# EAGLE schematic SM2000 (EAGLE 6.5.0)

## Sheet 1 of 4
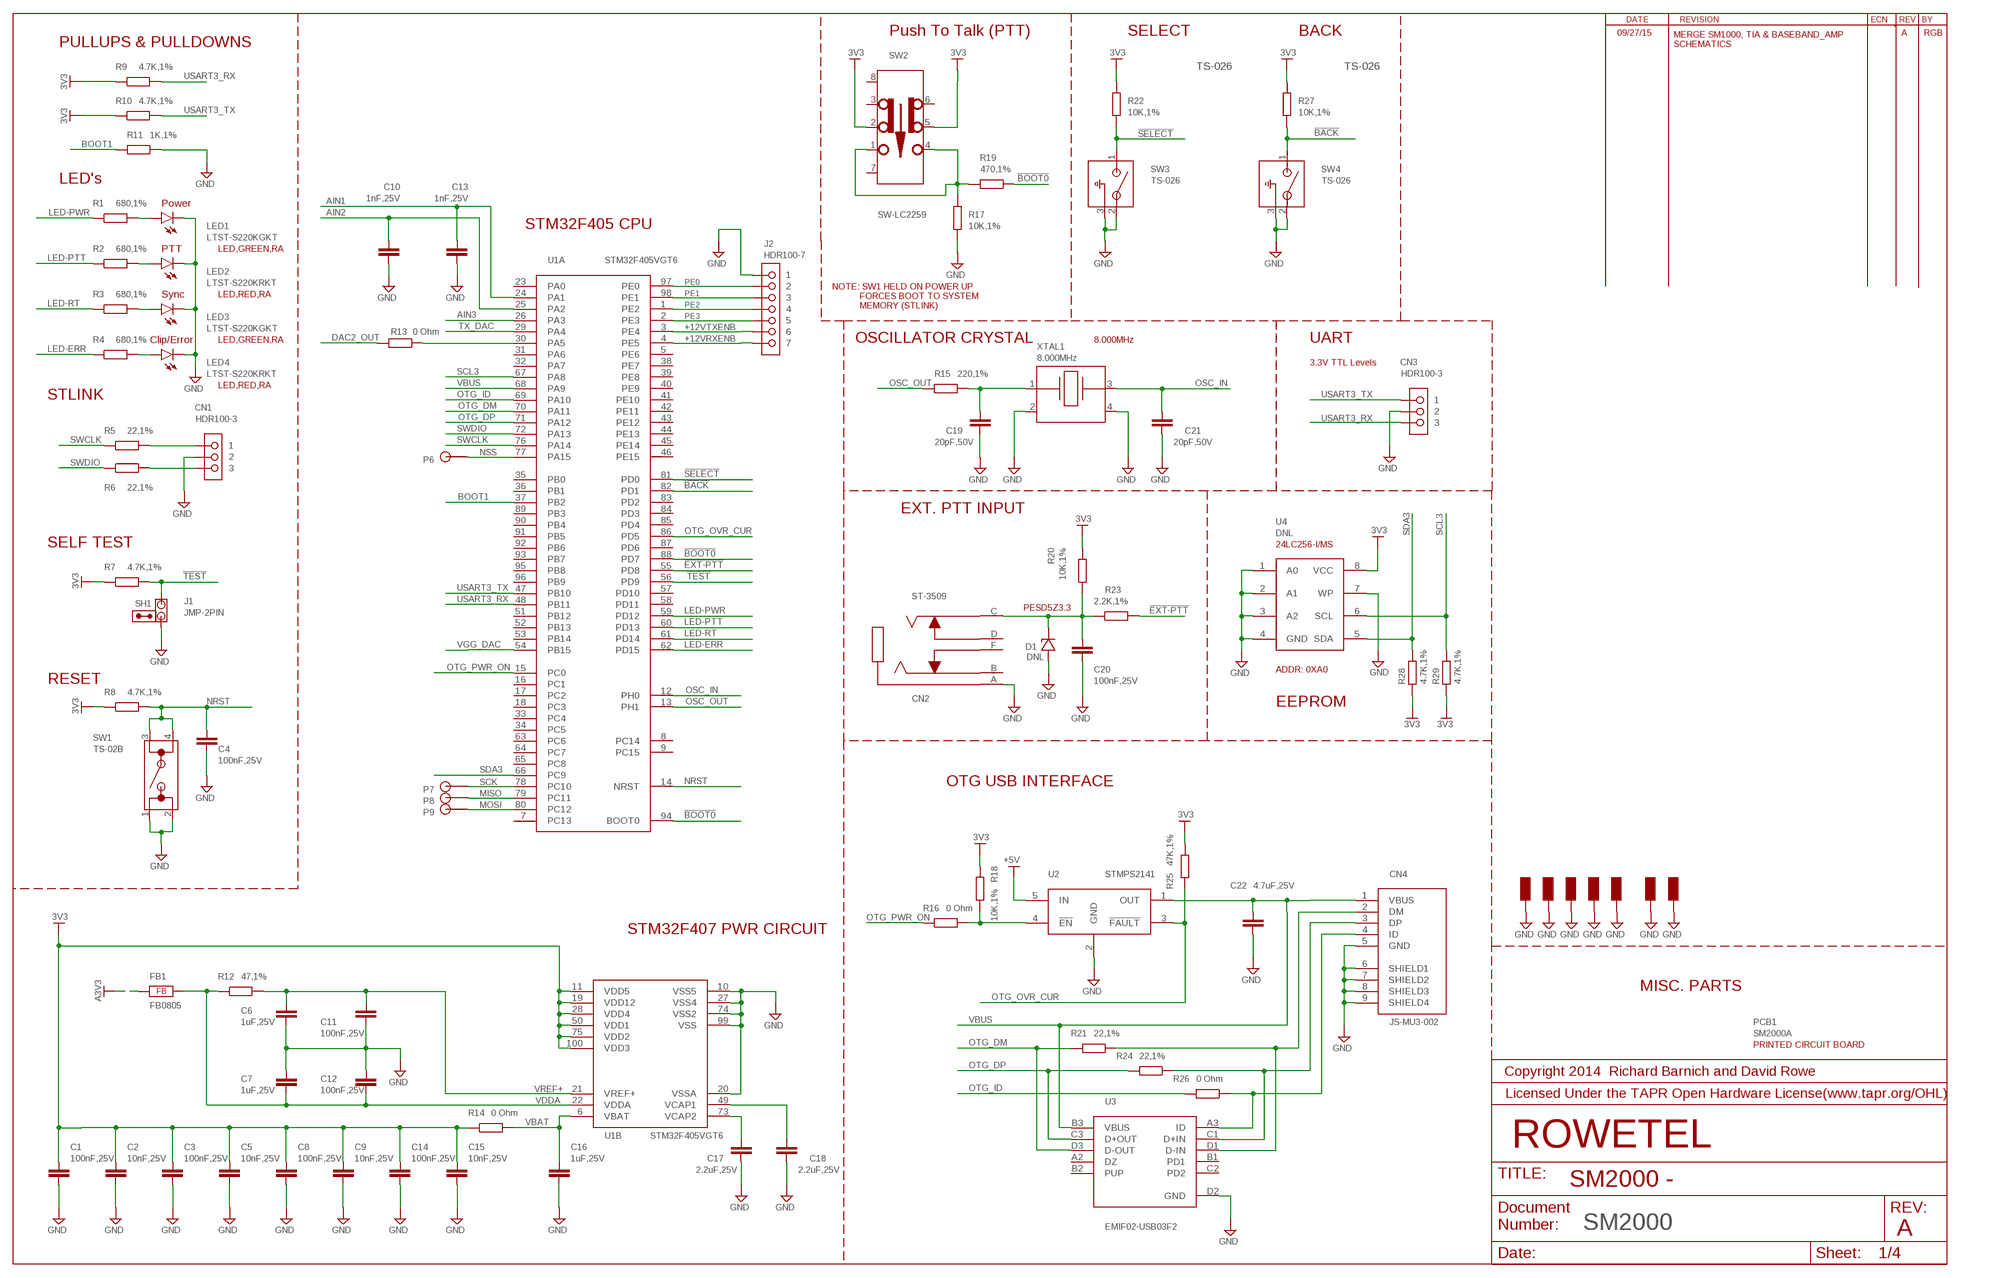
[diagram p0: schematic, sheet 1]

### Parts
C1  100nF,25V  CAP-0805  [C0805]
C2  10nF,25V  CAP-0805  [C0805]
C3  100nF,25V  CAP-0805  [C0805]
C4  100nF,25V  CAP-0805  [C0805]
C5  10nF,25V  CAP-0805  [C0805]
C6  1uF,25V  CAP-0805  [C0805]
C7  1uF,25V  CAP-0805  [C0805]
C8  100nF,25V  CAP-0805  [C0805]
C9  10nF,25V  CAP-0805  [C0805]
C10  1nF,25V  CAP-0805  [C0805]
C11  100nF,25V  CAP-0805  [C0805]
C12  100nF,25V  CAP-0805  [C0805]
C13  1nF,25V  CAP-0805  [C0805]
C14  100nF,25V  CAP-0805  [C0805]
C15  10nF,25V  CAP-0805  [C0805]
C16  1uF,25V  CAP-0805  [C0805]
C17  2.2uF,25V  CAP-0805  [C0805]
C18  2.2uF,25V  CAP-0805  [C0805]
C19  20pF,50V  CAP-0805  [C0805]
C20  100nF,25V  CAP-0805  [C0805]
C21  20pF,50V  CAP-0805  [C0805]
C22  4.7uF,25V  CAP-0805  [C0805]
CN1  HDR100-3  [HDR100-3]
CN2  ST-3509  [ST-3509]
CN3  HDR100-3  [HDR100-3]
CN4  JS-MU3-002  [JI-MU3-002]
D1  DNL  PESD5ZX  [SOD523]
FB1  FB0805  [FE0805]
J1  JMP-2PIN  [JMPR-2PIN]
J2  HDR100-7  [HDR100-7]
LED1  LTST-S220KGKT  LTST-S220K  [LTST-S2200K]
LED2  LTST-S220KRKT  LTST-S220K  [LTST-S2200K]
LED3  LTST-S220KGKT  LTST-S220K  [LTST-S2200K]
LED4  LTST-S220KRKT  LTST-S220K  [LTST-S2200K]
P6  TPAD50  [TPAD50]
P7  TPAD50  [TPAD50]
P8  TPAD50  [TPAD50]
P9  TPAD50  [TPAD50]
PCB1  SM2000A  PCB  [NOPACKAGE]
R1  680,1%  RES-0805  [R0805]
R2  680,1%  RES-0805  [R0805]
R3  680,1%  RES-0805  [R0805]
R4  680,1%  RES-0805  [R0805]
R5  22,1%  RES-0805  [R0805]
R6  22,1%  RES-0805  [R0805]
R7  4.7K,1%  RES-0805  [R0805]
R8  4.7K,1%  RES-0805  [R0805]
R9  4.7K,1%  RES-0805  [R0805]
R10  4.7K,1%  RES-0805  [R0805]
R11  1K,1%  RES-0805  [R0805]
R12  47,1%  RES-0805  [R0805]
R13  0 Ohm  RES-0805  [R0805]
R14  0 Ohm  RES-0805  [R0805]
R15  220,1%  RES-0805  [R0805]
R16  0 Ohm  RES-0805  [R0805]
R17  10K,1%  RES-0805  [R0805]
R18  10K,1%  RES-0805  [R0805]
R19  470,1%  RES-0805  [R0805]
R20  10K,1%  RES-0805  [R0805]
R21  22,1%  RES-0805  [R0805]
R22  10K,1%  RES-0805  [R0805]
R23  2.2K,1%  RES-0805  [R0805]
R24  22,1%  RES-0805  [R0805]
R25  47K,1%  RES-0805  [R0805]
R26  0 Ohm  RES-0805  [R0805]
R27  10K,1%  RES-0805  [R0805]
R28  4.7K,1%  RES-0805  [R0805]
R29  4.7K,1%  RES-0805  [R0805]
S1  SGND  [SGND]
S2  SGND  [SGND]
S3  SGND  [SGND]
S4  SGND  [SGND]
S5  SGND  [SGND]
S6  SGND  [SGND]
S7  SGND  [SGND]
SH1  SHUNT,0.1IN  [NOPACKAGE]
SW1  TS-02B  [TS-02B]
SW2  SW-LC2259  [SW-LC2259]
SW3  TS-026  [TS-026]
SW4  TS-026  [TS-026]
U1  STM32F405VGT6  STM32F407  [LQFP100-14]
U2  STMPS2141  [SOT23-5L]
U3  EMIF02-USB03F2  [ECOPACK-11]
U4  DNL  I2C-EEPROM-256K  [SOIC8]
XTAL1  8.000MHz  CTS-405  [CTS-405]

### Nets
3V3: C1.1 C2.1 C3.1 C5.1 C8.1 C9.1 C14.1 C15.1 R7.1 R8.1 R9.1 R10.1 R14.1 R18.2 R20.1 R22.2 R25.1 R27.2 R28.1 R29.1 SW2.2 SW2.5 U1.11(B:VDD5) U1.19(B:VDD12) U1.28(B:VDD4) U1.50(B:VDD1) U1.75(B:VDD2) U1.100(B:VDD3) U4.8(VCC) ; also sheet 2,4
!BACK!: R27.1 SW4.1 U1.82(A:PD1)
!BOOT0!: R19.1 U1.88(A:PD7) U1.94(A:BOOT0)
!EXT-PTT!: R23.2 U1.55(A:PD8)
!SELECT!: R22.1 SW3.1 U1.81(A:PD0)
!TEST!: J1.1 R7.2 U1.56(A:PD9)
+5V: U2.5(IN) ; also sheet 2,4
+12VRXENB: J2.7 U1.4(A:PE5) ; also sheet 2
+12VTXENB: J2.6 U1.3(A:PE4) ; also sheet 2
A3V3: FB1.1 ; also sheet 2,3
AIN1: C13.1 U1.24(A:PA1) ; also sheet 4
AIN2: C10.1 U1.25(A:PA2) ; also sheet 2
AIN3: U1.26(A:PA3) ; also sheet 3
BOOT1: R11.2 U1.37(A:PB2)
DAC2_OUT: R13.2 ; also sheet 2
GND: C1.2 C2.2 C3.2 C4.2 C5.2 C6.2 C7.2 C8.2 C9.2 C10.2 C11.2 C12.2 C13.2 C14.2 C15.2 C16.2 C17.2 C18.2 C19.2 C20.2 C21.2 C22.2 CN1.2 CN2.A CN3.2 CN4.5(GND) CN4.6(SHIELD1) CN4.7(SHIELD2) CN4.8(SHIELD3) CN4.9(SHIELD4) D1.A J1.2 J2.1 LED1.C LED2.C LED3.C LED4.C R11.1 R17.1 S1.SGND S2.SGND S3.SGND S4.SGND S5.SGND S6.SGND S7.SGND SW1.1 SW1.2 SW3.2 SW3.3 SW4.2 SW4.3 U1.10(B:VSS5) U1.20(B:VSSA) U1.27(B:VSS4) U1.74(B:VSS2) U1.99(B:VSS) U2.2(GND) U3.D2(GND) U4.1(A0) U4.2(A1) U4.3(A2) U4.4(GND) U4.7(WP) XTAL1.2 XTAL1.4 ; also sheet 2,3,4
LED-ERR: R4.1 U1.62(A:PD15)
LED-PTT: R2.1 U1.60(A:PD13)
LED-PWR: R1.1 U1.59(A:PD12)
LED-RT: R3.1 U1.61(A:PD14)
MISO: P8.1 U1.79(A:PC11)
MOSI: P9.1 U1.80(A:PC12)
N$1: C17.1 U1.73(B:VCAP2)
N$3: C18.1 U1.49(B:VCAP1)
N$6: CN1.3 R6.2
N$7: CN1.1 R5.2
N$10: C19.1 R15.2 XTAL1.1
N$13: R13.1 U1.30(A:PA5)
N$14: R17.2 R19.2 SW2.1 SW2.4
N$15: C20.1 CN2.C D1.C R20.2 R23.1
N$16: LED1.A R1.2
N$17: LED2.A R2.2
N$18: LED3.A R3.2
N$20: LED4.A R4.2
N$22: CN4.3(DP) R24.1 U3.C1(D+IN)
N$23: CN4.2(DM) R21.1 U3.D1(D-IN)
N$28: CN4.4(ID) R26.1 U3.A3(ID)
N$31: R16.2 R18.1 U2.4(!EN!)
NRST: C4.1 R8.2 SW1.3 SW1.4 U1.14(A:NRST)
NSS: P6.1 U1.77(A:PA15)
OSC_IN: C21.1 U1.12(A:PH0) XTAL1.3
OSC_OUT: R15.1 U1.13(A:PH1)
OTG_DM: R21.2 U1.70(A:PA11) U3.D3(D-OUT)
OTG_DP: R24.2 U1.71(A:PA12) U3.C3(D+OUT)
OTG_ID: R26.2 U1.69(A:PA10)
OTG_OVR_CUR: R25.2 U1.86(A:PD5) U2.3(!FAULT!)
OTG_PWR_ON: R16.1 U1.15(A:PC0)
PE0: J2.2 U1.97(A:PE0)
PE1: J2.3 U1.98(A:PE1)
PE2: J2.4 U1.1(A:PE2)
PE3: J2.5 U1.2(A:PE3)
SCK: P7.1 U1.78(A:PC10)
SCL3: R29.2 U1.67(A:PA8) U4.6(SCL) ; also sheet 4
SDA3: R28.2 U1.66(A:PC9) U4.5(SDA) ; also sheet 4
SWCLK: R5.1 U1.76(A:PA14)
SWDIO: R6.1 U1.72(A:PA13)
TX_DAC: U1.29(A:PA4) ; also sheet 4
USART3_RX: CN3.3 R9.2 U1.48(A:PB11)
USART3_TX: CN3.1 R10.2 U1.47(A:PB10)
VBAT: C16.1 R14.2 U1.6(B:VBAT)
VBUS: C22.1 CN4.1(VBUS) U1.68(A:PA9) U2.1(OUT) U3.B3(VBUS)
VDDA: C7.1 C12.1 FB1.2 R12.1 U1.22(B:VDDA)
VGG_DAC: U1.54(A:PB15) ; also sheet 3
VREF+: C6.1 C11.1 R12.2 U1.21(B:VREF+)
Unconnected: CN2.B CN2.D CN2.F(E) SW2.3 SW2.6 SW2.7 SW2.8 U1.5(A:PE6) U1.7(A:PC13) U1.8(A:PC14) U1.9(A:PC15) U1.16(A:PC1) U1.17(A:PC2) U1.18(A:PC3) U1.23(A:PA0) U1.31(A:PA6) U1.32(A:PA7) U1.33(A:PC4) U1.34(A:PC5) U1.35(A:PB0) U1.36(A:PB1) U1.38(A:PE7) U1.39(A:PE8) U1.40(A:PE9) U1.41(A:PE10) U1.42(A:PE11) U1.43(A:PE12) U1.44(A:PE13) U1.45(A:PE14) U1.46(A:PE15) U1.51(A:PB12) U1.52(A:PB13) U1.53(A:PB14) U1.57(A:PD10) U1.58(A:PD11) U1.63(A:PC6) U1.64(A:PC7) U1.65(A:PC8) U1.83(A:PD2) U1.84(A:PD3) U1.85(A:PD4) U1.87(A:PD6) U1.89(A:PB3) U1.90(A:PB4) U1.91(A:PB5) U1.92(A:PB6) U1.93(A:PB7) U1.95(A:PB8) U1.96(A:PB9) U3.A2(DZ) U3.B1(PD1) U3.B2(PUP) U3.C2(PD2)

### Notes on the sheet
- Push To Talk (PTT) | SELECT | BACK | 09/27/15 | A | RGB
- PULLUPS & PULLDOWNS
- MERGE SM1000, TIA & BASEBAND_AMP
  SCHEMATICS
- TS-026 | TS-026
- LED's
- Power
- STM32F405 CPU
- PTT | LED,GREEN,RA
- Sync | LED,RED,RA
- NOTE: SW1 HELD ON POWER UP
             FORCES BOOT TO SYSTEM
             MEMORY (STLINK)
- Clip/Error | LED,GREEN,RA | OSCILLATOR CRYSTAL | 8.000MHz | UART
- 3.3V TTL Levels
- LED,RED,RA
- STLINK
- EXT. PTT INPUT
- SELF TEST | 24LC256-I/MS
- PESD5Z3.3
- ADDR: 0XA0
- RESET
- EEPROM
- OTG USB INTERFACE
- STM32F407 PWR CIRCUIT
- MISC. PARTS
- SM2000 -
- A

## Sheet 2 of 4
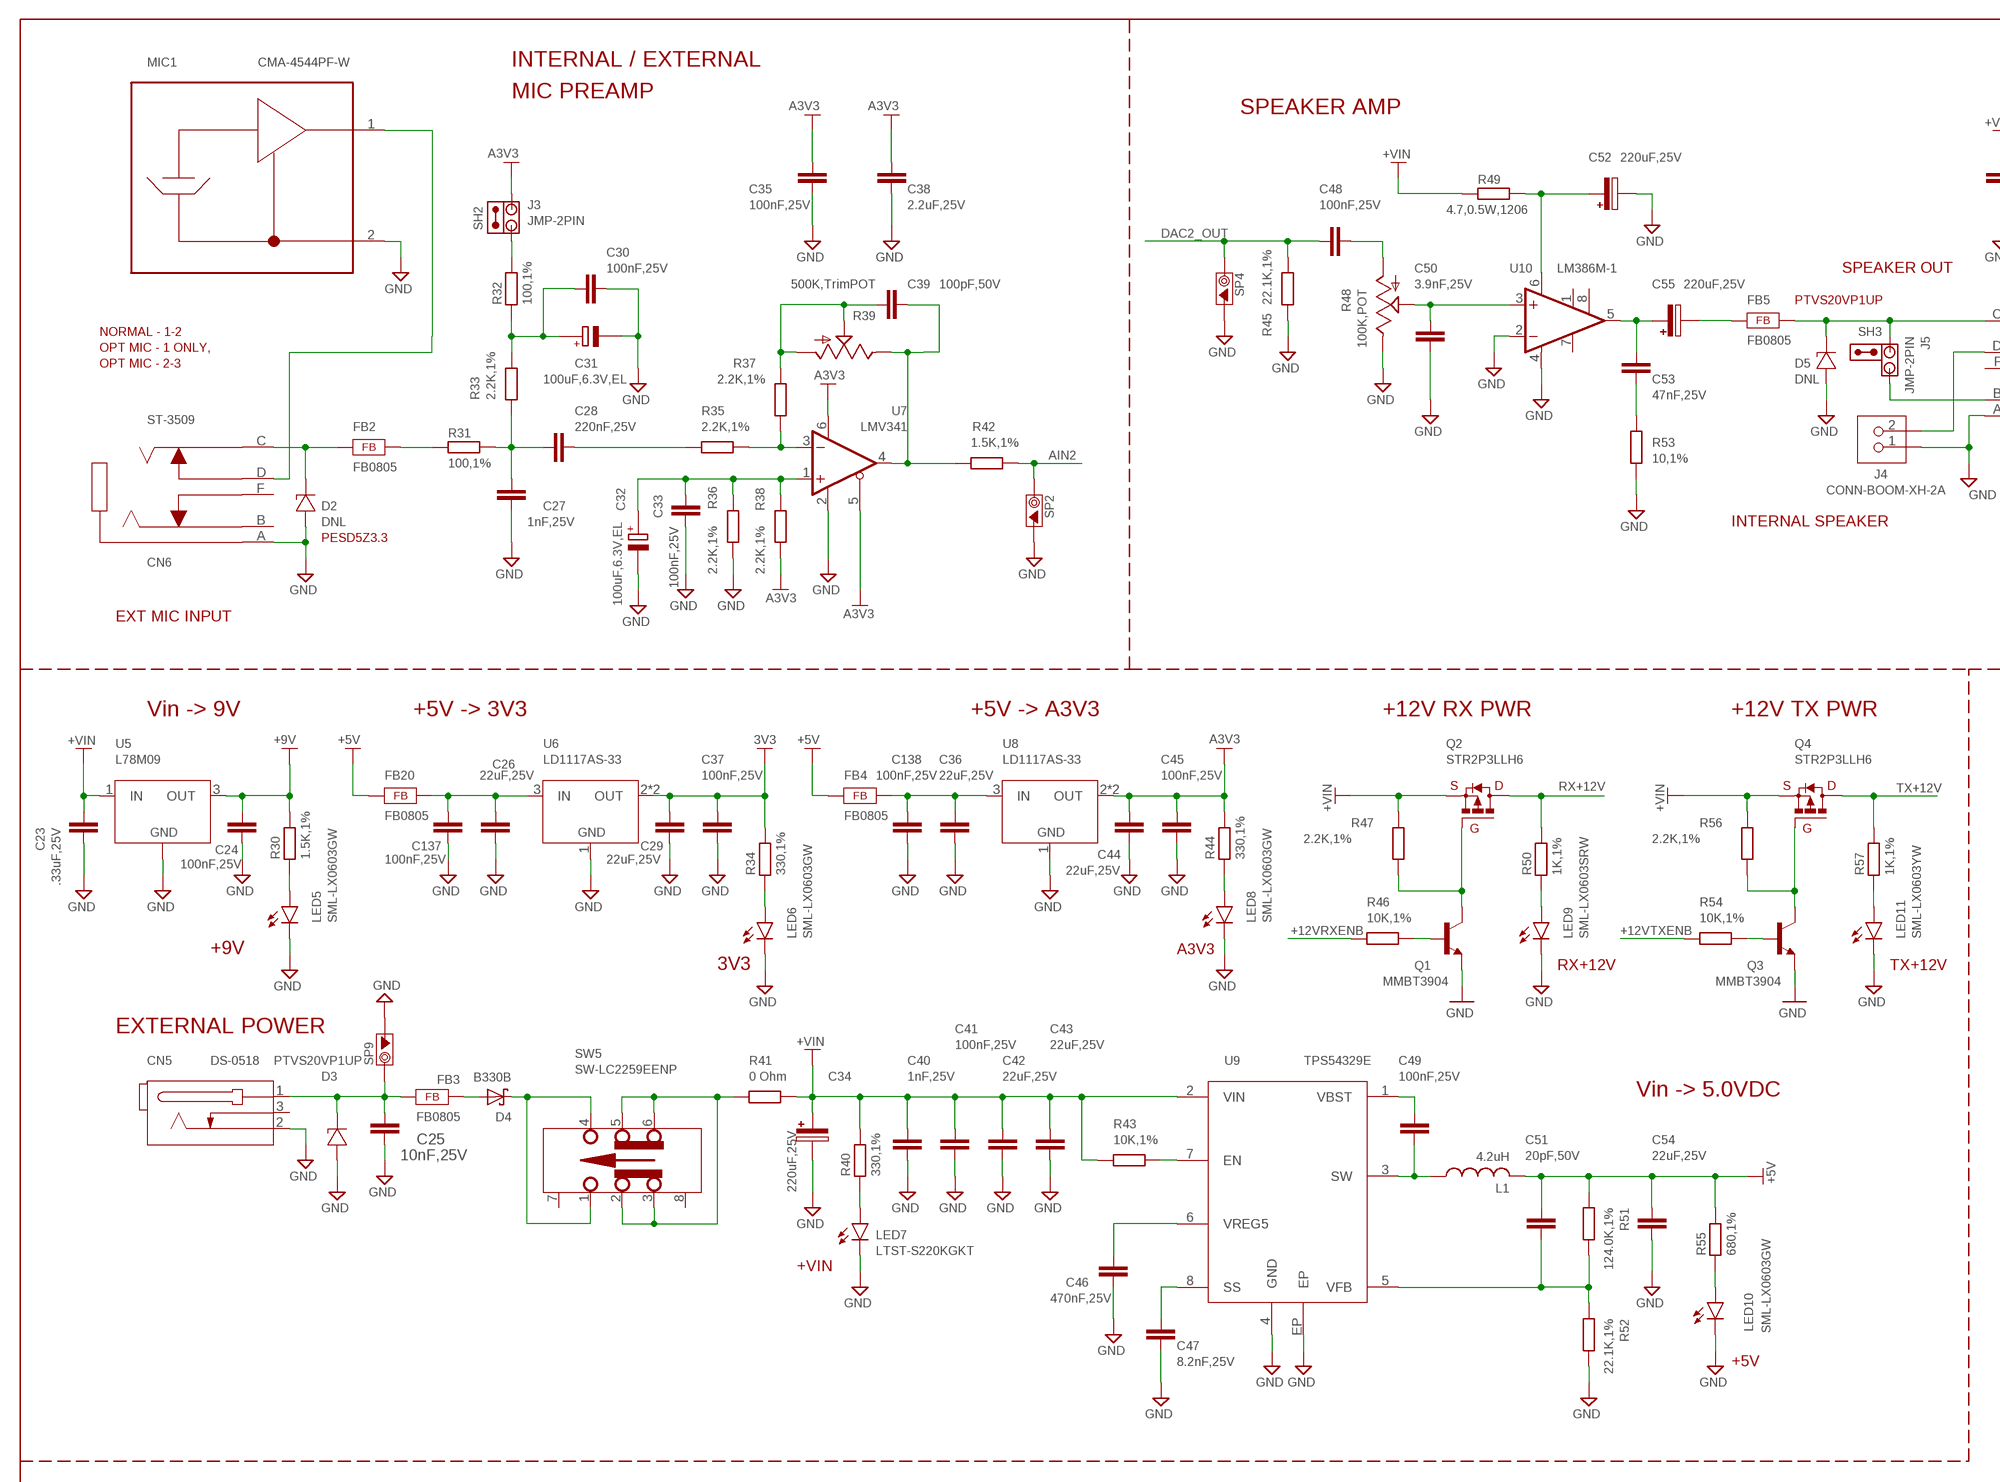
[diagram p1: schematic, sheet 2, part 1 of 2]
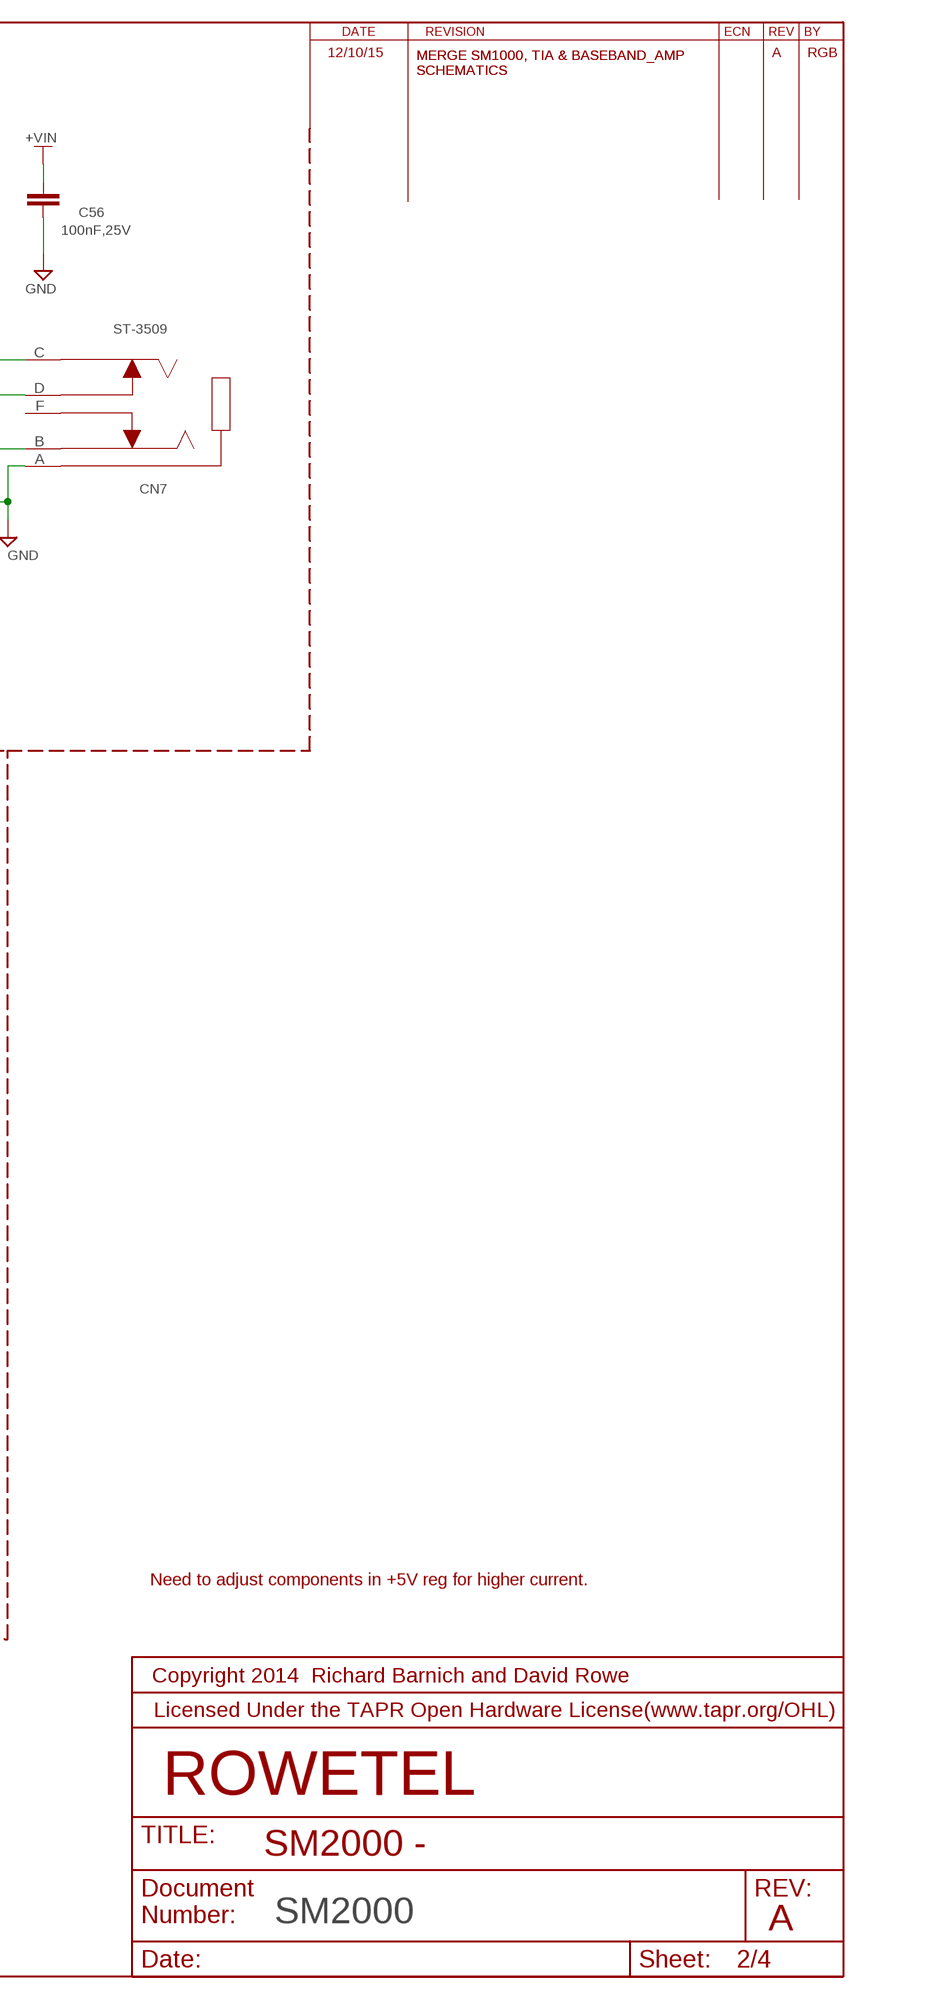
[diagram p2: schematic, sheet 2, part 2 of 2]

### Parts
C23  .33uF,25V  CAP-0805  [C0805]
C24  100nF,25V  CAP-0805  [C0805]
C25  10nF,25V  CAP-0805  [C0805]
C26  22uF,25V  CAP-1210  [C1210]
C27  1nF,25V  CAP-0805  [C0805]
C28  220nF,25V  CAP-0805  [C0805]
C29  22uF,25V  CAP-1210  [C1210]
C30  100nF,25V  CAP-0805  [C0805]
C31  100uF,6.3V,EL  NICHICON-WX-6.3  [NICHICON-WX-6.3]
C32  100uF,6.3V,EL  NICHICON-WX-6.3  [NICHICON-WX-6.3]
C33  100nF,25V  CAP-0805  [C0805]
C34  220uF,25V  CAP-CHEMI-MVE-HA0  [CAP-CHEMI-HA0]
C35  100nF,25V  CAP-0805  [C0805]
C36  22uF,25V  CAP-1210  [C1210]
C37  100nF,25V  CAP-0805  [C0805]
C38  2.2uF,25V  CAP-0805  [C0805]
C39  100pF,50V  CAP-0805  [C0805]
C40  1nF,25V  CAP-0805  [C0805]
C41  100nF,25V  CAP-0805  [C0805]
C42  22uF,25V  CAP-1210  [C1210]
C43  22uF,25V  CAP-1210  [C1210]
C44  22uF,25V  CAP-1210  [C1210]
C45  100nF,25V  CAP-0805  [C0805]
C46  470nF,25V  CAP-0805  [C0805]
C47  8.2nF,25V  CAP-0805  [C0805]
C48  100nF,25V  CAP-0805  [C0805]
C49  100nF,25V  CAP-0805  [C0805]
C50  3.9nF,25V  CAP-0805  [C0805]
C51  20pF,50V  CAP-0805  [C0805]
C52  220uF,25V  CAP-CHEMI-MVE-HA0  [CAP-CHEMI-HA0]
C53  47nF,25V  CAP-0805  [C0805]
C54  22uF,25V  CAP-1210  [C1210]
C55  220uF,25V  CAP-CHEMI-MVE-HA0  [CAP-CHEMI-HA0]
C56  100nF,25V  CAP-0805  [C0805]
C137  100nF,25V  CAP-0805  [C0805]
C138  100nF,25V  CAP-0805  [C0805]
CN5  DS-0518  [DS-0518]
CN6  ST-3509  [ST-3509]
CN7  ST-3509  [ST-3509]
D2  DNL  PESD5ZX  [SOD523]
D3  PTVS20VP1UP  [SOD128]
D4  B330B  [SMB]
D5  DNL  PTVS20VP1UP  [SOD128]
FB2  FB0805  [FE0805]
FB3  FB0805  [FE0805]
FB4  FB0805  [FE0805]
FB5  FB0805  [FE0805]
FB20  FB0805  [FE0805]
J3  JMP-2PIN  [JMPR-2PIN]
J4  CONN-BOOM-XH-2A  [CONN-BOOM-XH-2A]
J5  JMP-2PIN  [JMPR-2PIN]
L1  4.2uH  SRR5028  [SRR5028]
LED5  SML-LX0603GW  SML-LX0603SRW  [SML-LX0603SRW]
LED6  SML-LX0603GW  SML-LX0603SRW  [SML-LX0603SRW]
LED7  LTST-S220KGKT  LTST-S220K  [LTST-S2200K]
LED8  SML-LX0603GW  SML-LX0603SRW  [SML-LX0603SRW]
LED9  SML-LX0603SRW  [SML-LX0603SRW]
LED10  SML-LX0603GW  SML-LX0603SRW  [SML-LX0603SRW]
LED11  SML-LX0603YW  SML-LX0603SRW  [SML-LX0603SRW]
MIC1  CMA-4544PF-W  [CMA-4544PF-W]
Q1  MMBT3904  [SOT23]
Q2  STR2P3LLH6  [SOT23]
Q3  MMBT3904  [SOT23]
Q4  STR2P3LLH6  [SOT23]
R30  1.5K,1%  RES-0805  [R0805]
R31  100,1%  RES-0805  [R0805]
R32  100,1%  RES-0805  [R0805]
R33  2.2K,1%  RES-0805  [R0805]
R34  330,1%  RES-0805  [R0805]
R35  2.2K,1%  RES-0805  [R0805]
R36  2.2K,1%  RES-0805  [R0805]
R37  2.2K,1%  RES-0805  [R0805]
R38  2.2K,1%  RES-0805  [R0805]
R39  500K,TrimPOT  POT3361  [POT3361]
R40  330,1%  RES-0805  [R0805]
R41  0 Ohm  RES-0805  [R0805]
R42  1.5K,1%  RES-0805  [R0805]
R43  10K,1%  RES-0805  [R0805]
R44  330,1%  RES-0805  [R0805]
R45  22.1K,1%  RES-0805  [R0805]
R46  10K,1%  RES-0805  [R0805]
R47  2.2K,1%  RES-0805  [R0805]
R48  100K,POT  POT-3310C  [POT-3310C]
R49  4.7,0.5W,1206  RES-1206  [R1206]
R50  1K,1%  RES-0805  [R0805]
R51  124.0K,1%  RES-0805  [R0805]
R52  22.1K,1%  RES-0805  [R0805]
R53  10,1%  RES-0805  [R0805]
R54  10K,1%  RES-0805  [R0805]
R55  680,1%  RES-0805  [R0805]
R56  2.2K,1%  RES-0805  [R0805]
R57  1K,1%  RES-0805  [R0805]
SH2  SHUNT,0.1IN  [NOPACKAGE]
SH3  SHUNT,0.1IN  [NOPACKAGE]
SP2  SCOPE_PAD  [SCOPE_PAD]
SP4  SCOPE_PAD  [SCOPE_PAD]
SP9  SCOPE_PAD  [SCOPE_PAD]
SW5  SW-LC2259EENP  SW-LC2259  [SW-LC2259]
U5  L78M09  L78MXX  [DPAK]
U6  LD1117AS-33  LD1117AS33  [SOT223]
U7  LMV341  [SOT23-6]
U8  LD1117AS-33  LD1117AS33  [SOT223]
U9  TPS54329E  [PSO-DDA]
U10  LM386M-1  [SO08]

### Nets
3V3: C29.1 C37.1 R34.2 U6.2(OUT) U6.4(OUT) ; also sheet 1,4
+5V: C51.1 C54.1 FB4.1 FB20.1 L1.2 R51.1 R55.2 ; also sheet 1,4
+9V: C24.1 R30.2 U5.3(OUT) ; also sheet 3
+12VRXENB: R46.1 ; also sheet 1
+12VTXENB: R54.1 ; also sheet 1
+VIN: C23.1 C34.1 C40.1 C41.1 C42.1 C43.1 C56.1 Q2.2(S) Q4.2(S) R40.2 R41.2 R43.1 R47.2 R49.1 R56.2 U5.1(IN) U9.2(VIN)
A3V3: C35.1 C38.1 C44.1 C45.1 J3.2 R38.2 R44.2 U7.5(!SHDN!) U7.6(V+) U8.2(OUT) U8.4(OUT) ; also sheet 1,3
AIN2: R42.1 SP2.1 ; also sheet 1
DAC2_OUT: C48.1 R45.1 SP4.1 ; also sheet 1
GND: C23.2 C24.2 C25.2 C26.2 C27.2 C29.2 C30.2 C31.2(-) C32.2(-) C33.1 C34.2 C35.2 C36.2 C37.2 C38.2 C40.2 C41.2 C42.2 C43.2 C44.2 C45.2 C46.2 C47.2 C50.2 C52.2 C54.2 C56.2 C137.2 C138.2 CN5.2 CN6.A CN7.A D2.A D3.A D5.A J4.1 LED5.C LED6.C LED7.C LED8.C LED9.C LED10.C LED11.C MIC1.2 Q1.2(E) Q3.2(E) R36.2 R45.2 R48.1 R52.2 R53.2 SP2.2 SP4.2 SP9.2 U5.4(GND) U6.1(GND) U7.2(GND) U8.1(GND) U9.4(GND) U9.EP U10.2(-IN) U10.4(GND) ; also sheet 1,3,4
N$8: C53.1 C55.1 U10.5(OUT)
N$24: D4.A FB3.2
N$25: C27.1 C28.1 R31.2 R33.1
N$26: FB2.2 R31.1
N$27: C39.2 R39.1 R42.2 U7.4(OUT)
N$29: J3.1 R32.2
N$34: C48.2 R48.3
N$35: C28.2 R35.1
N$39: C50.1 R48.2 U10.3(+IN)
N$41: C39.1 R37.2 R39.2 R39.3
N$42: Q1.3(C) Q2.1(G) R47.1
N$43: C53.2 R53.1
N$44: C55.2 FB5.1
N$45: C30.1 C31.1(+) R32.1 R33.2
N$46: C32.1(+) C33.2 R36.1 R38.1 U7.1(+IN)
N$48: C52.1 R49.2 U10.6(VS)
N$50: Q3.3(C) Q4.1(G) R56.1
N$53: Q1.1(B) R46.2
N$54: C36.1 C138.1 FB4.2 U8.3(IN)
N$55: Q3.1(B) R54.2
N$60: CN6.D MIC1.1
N$62: CN7.C D5.C FB5.2 J5.2
N$63: LED5.A R30.1
N$64: CN7.B J5.1
N$72: CN7.D J4.2
N$76: CN6.C D2.C FB2.1
N$77: C25.1 CN5.1 D3.C FB3.1 SP9.1
N$81: D4.C(K) SW5.1 SW5.4
N$87: R35.2 R37.1 U7.3(-IN)
N$110: C26.1 C137.1 FB20.2 U6.3(IN)
N$127: LED8.A R44.1
N$131: LED9.A R50.1
N$132: LED6.A R34.1
N$133: LED11.A R57.1
N$134: LED10.A R55.1
N$138: LED7.A R40.1
N$150: R41.1 SW5.2 SW5.3 SW5.5 SW5.6
N$169: C49.1 U9.1(VBST)
N$170: C51.2 R51.2 R52.1 U9.5(VFB)
N$171: C47.1 U9.8(SS)
N$172: C46.1 U9.6(VREG5)
N$173: R43.2 U9.7(EN)
RX+12V: Q2.3(D) R50.2 ; also sheet 3
SW: C49.2 L1.1 U9.3(SW)
TX+12V: Q4.3(D) R57.2 ; also sheet 3
Unconnected: CN5.3 CN6.B CN6.F(E) CN7.F(E) SW5.7 SW5.8 U10.1(GAIN) U10.7(BYPASS) U10.8(GAIN)

### Notes on the sheet
- 12/10/15 | A | RGB
- INTERNAL / EXTERNAL
- MERGE SM1000, TIA & BASEBAND_AMP 
  SCHEMATICS
- MERGE SM1000, TIA & BASEBAND_AMP 
  SCHEMATICS
- MIC PREAMP
- SPEAKER AMP
- SPEAKER OUT
- PTVS20VP1UP
- NORMAL - 1-2
- OPT MIC - 1 ONLY,
- OPT MIC - 2-3
- INTERNAL SPEAKER
- PESD5Z3.3
- EXT MIC INPUT
- Vin -> 9V | +5V -> 3V3 | +5V -> A3V3 | +12V RX PWR | +12V TX PWR
- +9V | A3V3
- 3V3 | RX+12V | TX+12V
- EXTERNAL POWER
- Vin -> 5.0VDC
- +VIN
- +5V
- Need to adjust components in +5V reg for higher current.
- SM2000 -
- A

## Sheet 3 of 4
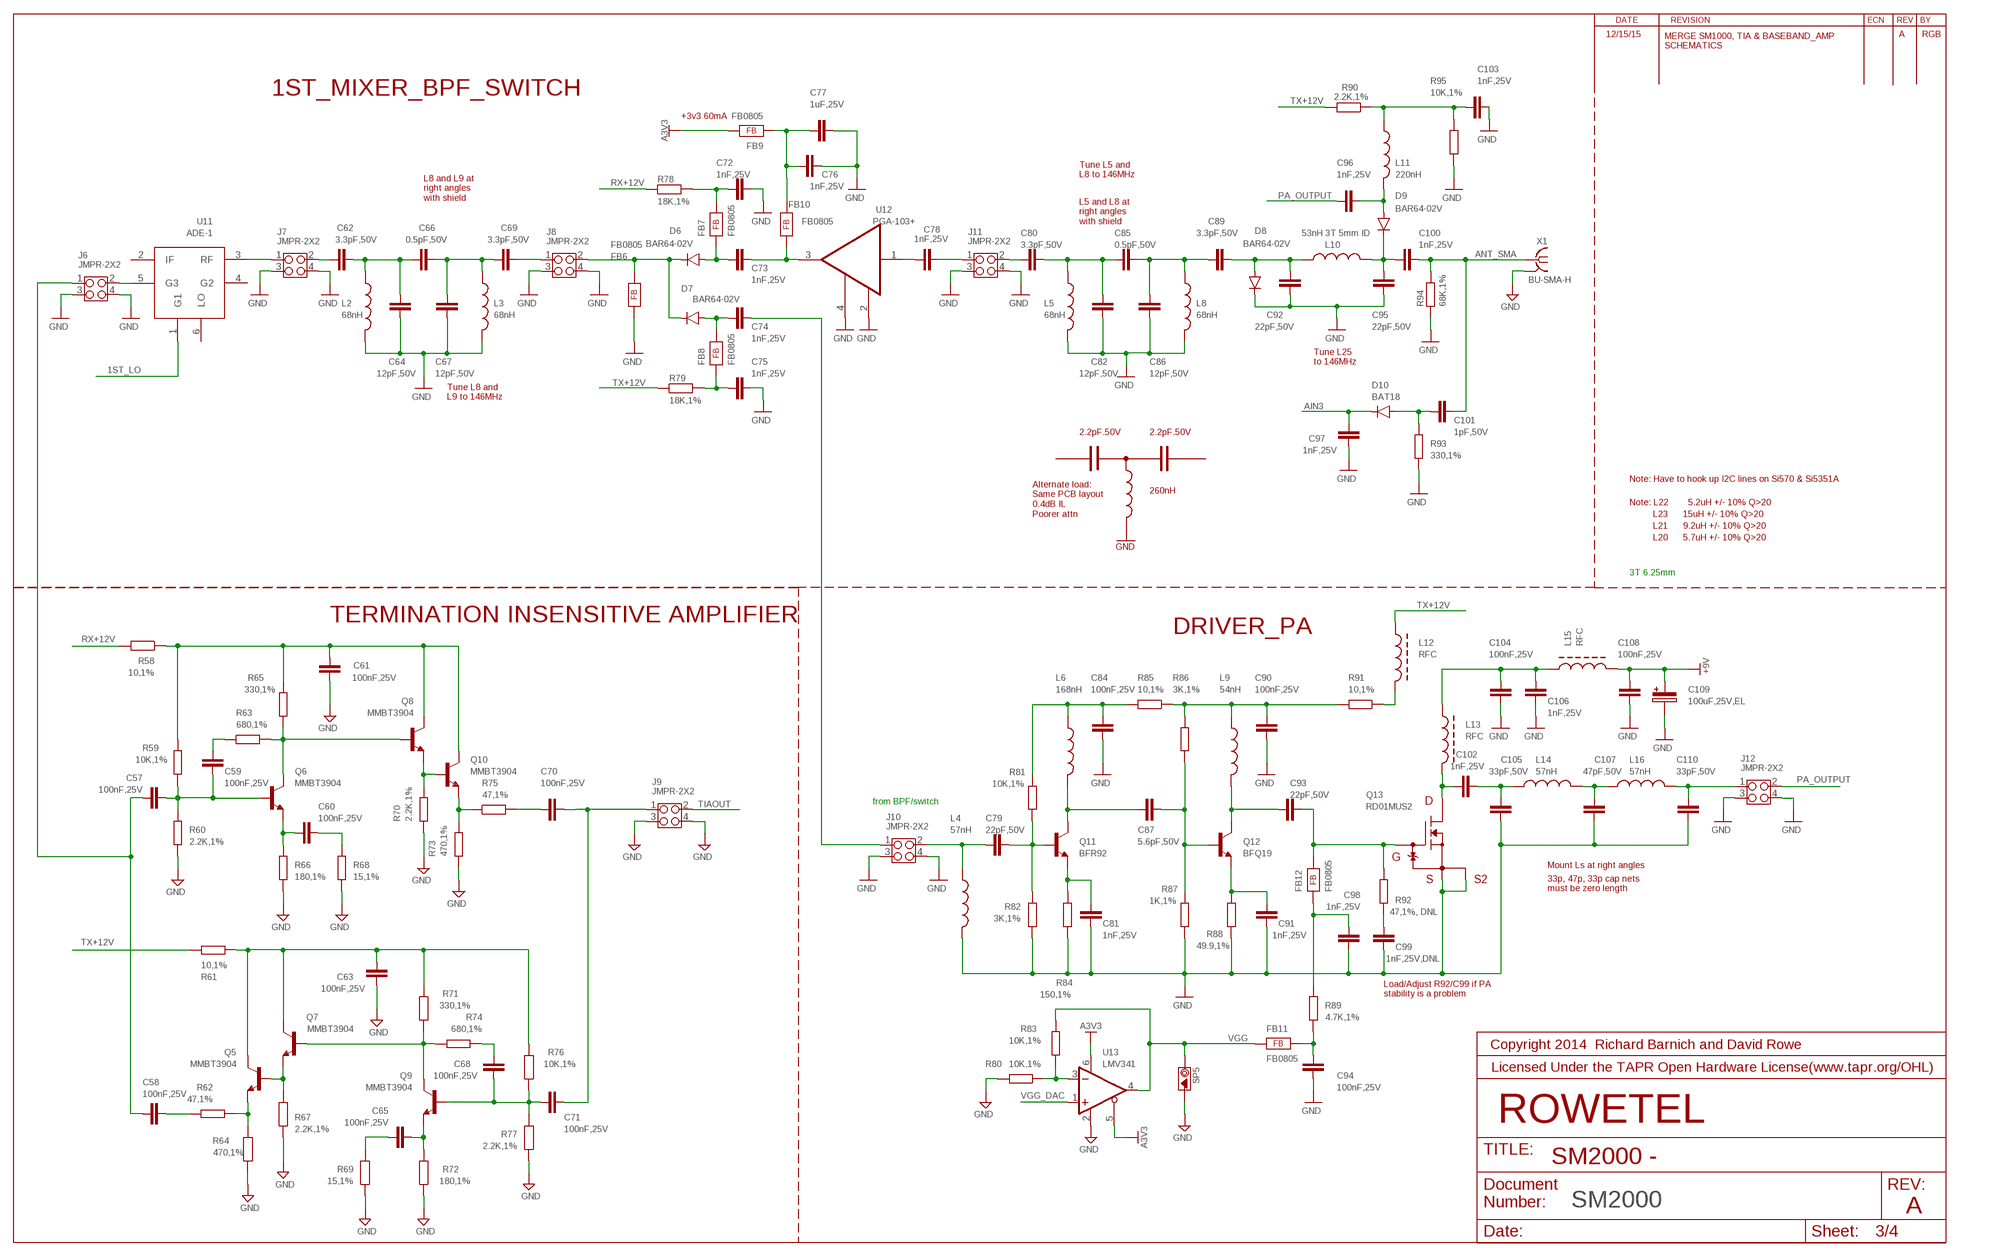
[diagram p3: schematic, sheet 3]

### Parts
C57  100nF,25V  CAP-0805  [C0805]
C58  100nF,25V  CAP-0805  [C0805]
C59  100nF,25V  CAP-0805  [C0805]
C60  100nF,25V  CAP-0805  [C0805]
C61  100nF,25V  CAP-0805  [C0805]
C62  3.3pF,50V  CAP-0805  [C0805]
C63  100nF,25V  CAP-0805  [C0805]
C64  12pF,50V  CAP-0805  [C0805]
C65  100nF,25V  CAP-0805  [C0805]
C66  0.5pF,50V  CAP-0805  [C0805]
C67  12pF,50V  CAP-0805  [C0805]
C68  100nF,25V  CAP-0805  [C0805]
C69  3.3pF,50V  CAP-0805  [C0805]
C70  100nF,25V  CAP-0805  [C0805]
C71  100nF,25V  CAP-0805  [C0805]
C72  1nF,25V  CAP-0805  [C0805]
C73  1nF,25V  CAP-0805  [C0805]
C74  1nF,25V  CAP-0805  [C0805]
C75  1nF,25V  CAP-0805  [C0805]
C76  1nF,25V  CAP-0805  [C0805]
C77  1uF,25V  CAP-0805  [C0805]
C78  1nF,25V  CAP-0805  [C0805]
C79  22pF,50V  CAP-0805  [C0805]
C80  3.3pF,50V  CAP-0805  [C0805]
C81  1nF,25V  CAP-0805  [C0805]
C82  12pF,50V  CAP-0805  [C0805]
C84  100nF,25V  CAP-0805  [C0805]
C85  0.5pF,50V  CAP-0805  [C0805]
C86  12pF,50V  CAP-0805  [C0805]
C87  5.6pF,50V  CAP-0805  [C0805]
C89  3.3pF,50V  CAP-0805  [C0805]
C90  100nF,25V  CAP-0805  [C0805]
C91  1nF,25V  CAP-0805  [C0805]
C92  22pF,50V  CAP-0805  [C0805]
C93  22pF,50V  CAP-0805  [C0805]
C94  100nF,25V  CAP-0805  [C0805]
C95  22pF,50V  CAP-0805  [C0805]
C96  1nF,25V  CAP-0805  [C0805]
C97  1nF,25V  CAP-0805  [C0805]
C98  1nF,25V  CAP-0805  [C0805]
C99  1nF,25V,DNL  CAP-0805  [C0805]
C100  1nF,25V  CAP-0805  [C0805]
C101  1pF,50V  CAP-0805  [C0805]
C102  1nF,25V  CAP-0805  [C0805]
C103  1nF,25V  CAP-0805  [C0805]
C104  100nF,25V  CAP-0805  [C0805]
C105  33pF,50V  CAP-0805  [C0805]
C106  1nF,25V  CAP-0805  [C0805]
C107  47pF,50V  CAP-0805  [C0805]
C108  100nF,25V  CAP-0805  [C0805]
C109  100uF,25V,EL  CAP-CHEMI-F80  [CAP-CHEMI-F80]
C110  33pF,50V  CAP-0805  [C0805]
D6  BAR64-02V  [SC79_INFINEON]
D7  BAR64-02V  [SC79_INFINEON]
D8  BAR64-02V  [SC79_INFINEON]
D9  BAR64-02V  [SC79_INFINEON]
D10  BAT18  [SOT23]
FB6  FB0805  [FE0805]
FB7  FB0805  [FE0805]
FB8  FB0805  [FE0805]
FB9  FB0805  [FE0805]
FB10  FB0805  [FE0805]
FB11  FB0805  [FE0805]
FB12  FB0805  [FE0805]
J6  JMPR-2X2  [JMPR-2X2X.1]
J7  JMPR-2X2  [JMPR-2X2X.1]
J8  JMPR-2X2  [JMPR-2X2X.1]
J9  JMPR-2X2  [JMPR-2X2X.1]
J10  JMPR-2X2  [JMPR-2X2X.1]
J11  JMPR-2X2  [JMPR-2X2X.1]
J12  JMPR-2X2  [JMPR-2X2X.1]
L2  68nH  L-ROWE_15X10  [L10X15]
L3  68nH  L-ROWE_15X10  [L10X15]
L4  57nH  L-ROWE_15X10  [L10X15]
L5  68nH  L-ROWE_15X10  [L10X15]
L6  168nH  L-ROWE_15X10  [L10X15]
L8  68nH  L-ROWE_15X10  [L10X15]
L9  54nH  L-ROWE_15X10  [L10X15]
L10  53nH 3T 5mm ID  L-ROWE_15X10  [L10X15]
L11  220nH  L-ROWE_15X10  [L10X15]
L12  RFC  [Z15/4]
L13  RFC  [Z15/4]
L14  57nH  L-ROWE_15X10  [L10X15]
L15  RFC  [Z15/4]
L16  57nH  L-ROWE_15X10  [L10X15]
Q5  MMBT3904  [SOT23]
Q6  MMBT3904  [SOT23]
Q7  MMBT3904  [SOT23]
Q8  MMBT3904  [SOT23]
Q9  MMBT3904  [SOT23]
Q10  MMBT3904  [SOT23]
Q11  BFR92  [SOT23]
Q12  BFQ19  [SOT89]
Q13  RD01MUS2  [SOT89]
R58  10,1%  RES-0805  [R0805]
R59  10K,1%  RES-0805  [R0805]
R60  2.2K,1%  RES-0805  [R0805]
R61  10,1%  RES-0805  [R0805]
R62  47,1%  RES-0805  [R0805]
R63  680,1%  RES-0805  [R0805]
R64  470,1%  RES-0805  [R0805]
R65  330,1%  RES-0805  [R0805]
R66  180,1%  RES-0805  [R0805]
R67  2.2K,1%  RES-0805  [R0805]
R68  15,1%  RES-0805  [R0805]
R69  15,1%  RES-0805  [R0805]
R70  2.2K,1%  RES-0805  [R0805]
R71  330,1%  RES-0805  [R0805]
R72  180,1%  RES-0805  [R0805]
R73  470,1%  RES-0805  [R0805]
R74  680,1%  RES-0805  [R0805]
R75  47,1%  RES-0805  [R0805]
R76  10K,1%  RES-0805  [R0805]
R77  2.2K,1%  RES-0805  [R0805]
R78  18K,1%  RES-0805  [R0805]
R79  18K,1%  RES-0805  [R0805]
R80  10K,1%  RES-0805  [R0805]
R81  10K,1%  RES-0805  [R0805]
R82  3K,1%  RES-0805  [R0805]
R83  10K,1%  RES-0805  [R0805]
R84  150,1%  RES-0805  [R0805]
R85  10,1%  RES-0805  [R0805]
R86  3K,1%  RES-0805  [R0805]
R87  1K,1%  RES-0805  [R0805]
R88  49.9,1%  RES-0805  [R0805]
R89  4.7K,1%  RES-0805  [R0805]
R90  2.2K,1%  RES-0805  [R0805]
R91  10,1%  RES-0805  [R0805]
R92  47,1%, DNL  RES-0805  [R0805]
R93  330,1%  RES-0805  [R0805]
R94  68K,1%  RES-0805  [R0805]
R95  10K,1%  RES-0805  [R0805]
SP5  SCOPE_PAD  [SCOPE_PAD]
U11  ADE-1  [ADE-1]
U12  PGA-103+  [DF782]
U13  LMV341  [SOT23-6]
X1  BU-SMA-H  [BU-SMA-H]

### Nets
1ST_LO: U11.1(G1) ; also sheet 4
+9V: C108.1 C109.1 L15.2 ; also sheet 2
A3V3: FB9.2 U13.5(!SHDN!) U13.6(V+) ; also sheet 1,2
AIN3: C97.2 D10.1(K) ; also sheet 1
ANT_SMA: C100.1 C101.2 R94.2 X1.1
DRIVER/PA_INPUT: C74.2 J10.1
GND: C61.2 C63.2 C64.2 C67.1 C72.2 C75.2 C76.2 C77.2 C81.2 C82.2 C84.2 C86.1 C90.2 C91.2 C92.2 C94.2 C95.2 C97.1 C98.2 C99.2 C103.2 C104.2 C105.2 C106.2 C107.2 C108.2 C109.2 C110.2 D8.C FB6.1 J6.3 J6.4 J7.3 J7.4 J8.3 J8.4 J9.3 J9.4 J10.3 J10.4 J11.3 J11.4 J12.3 J12.4 L2.2 L3.2 L4.2 L5.2 L8.2 Q13.2(S) Q13.4(S2) R60.1 R64.1 R66.1 R67.1 R68.1 R69.1 R70.1 R72.1 R73.1 R77.1 R80.2 R82.1 R84.1 R87.1 R88.1 R93.1 R94.1 R95.1 SP5.2 U12.2(GND) U12.4(GND1) U13.2(GND) X1.2 X1.3 X1.4 X1.5 ; also sheet 1,2,4
N$4: C76.1 C77.1 FB9.1 FB10.2
N$9: C107.1 L14.2 L16.1
N$11: C80.2 J11.2
N$19: L12.2 R91.1
N$21: C62.1 C64.1 C66.2 L2.1
N$32: C102.1 L13.2 Q13.3(D)
N$33: C93.1 FB12.2 Q13.1(G) R92.2
N$37: C95.1 C100.2 D9.C L10.2
N$38: C94.1 FB11.2 R89.1
N$52: C110.1 J12.1 L16.2
N$56: C62.2 J7.2
N$57: C101.1 D10.3(A) R93.2
N$58: J7.1 U11.3(RF)
N$59: C78.2 J11.1
N$61: C78.1 U12.1(1N)
N$66: Q6.3(C) Q8.1(B) R63.2 R65.2
N$67: C61.1 Q8.3(C) Q10.3(C) R58.1 R59.2 R65.1
N$68: Q8.2(E) Q10.1(B) R70.2
N$69: C59.1 R63.1
N$70: C81.1 Q11.2(E) R84.2
N$71: C91.1 Q12.3(E) R88.2
N$73: C84.1 L6.1 R81.2 R85.2
N$74: C90.1 L9.1 R85.1 R86.2 R91.2
N$75: C87.1 Q12.1(B) R86.1 R87.2
N$78: C79.1 Q11.1(B) R81.1 R82.2
N$79: C69.1 J8.1
N$82: C87.2 L6.2 Q11.3(C)
N$83: C57.1 C59.2 Q6.1(B) R59.1 R60.2
N$84: C93.2 L9.2 Q12.2(C) Q12.4(C)
N$85: C60.1 Q6.2(E) R66.2
N$86: C60.2 R68.2
N$88: Q10.2(E) R73.2 R75.1
N$89: C70.2 R75.2
N$90: J6.2 U11.5(G3)
N$91: Q7.1(B) Q9.3(C) R71.2 R74.2
N$92: C63.1 Q5.3(C) Q7.3(C) R61.2 R71.1 R76.2
N$93: Q5.1(B) Q7.2(E) R67.2
N$94: C68.1 R74.1
N$95: C68.2 C71.1 Q9.1(B) R76.1 R77.2
N$96: C65.1 Q9.2(E) R72.2
N$97: C65.2 R69.2
N$98: Q5.2(E) R62.1 R64.2
N$99: C58.2 R62.2
N$100: C72.1 FB7.2 R78.2
N$112: C79.2 J10.2 L4.1
N$113: C99.1 R92.1
N$114: C98.1 FB12.1 R89.2
N$115: C73.1 D6.A FB7.1
N$116: C73.2 FB10.1 U12.3(OUT)
N$117: C74.1 D7.A FB8.2
N$118: C102.2 C105.1 L14.1
N$125: C75.1 FB8.1 R79.2
N$126: C66.1 C67.2 C69.2 L3.1
N$128: R80.1 R83.1 U13.3(-IN)
N$130: C104.1 C106.1 L13.1 L15.1
N$135: D6.C D7.C FB6.2 J8.2
N$136: C80.1 C82.1 C85.2 L5.1
N$137: C85.1 C86.2 C89.2 L8.1
N$149: C89.1 C92.1 D8.A L10.1
N$157: C96.1 D9.A L11.2
N$158: C103.1 L11.1 R90.1 R95.2
PA_OUTPUT: C96.2 J12.2
RX+12V: R58.2 R78.1 ; also sheet 2
TIA_OUT: C70.1 C71.2 J9.1
TIAIN: C57.2 C58.1 J6.1
TIAOUT: J9.2 ; also sheet 4
TX+12V: L12.1 R61.1 R79.1 R90.2 ; also sheet 2
VGG: FB11.1 R83.2 SP5.1 U13.4(OUT)
VGG_DAC: U13.1(+IN) ; also sheet 1
Unconnected: U11.2(IF) U11.4(G2) U11.6(LO)

### Notes on the sheet
- 12/15/15 | A | RGB
- MERGE SM1000, TIA & BASEBAND_AMP
  SCHEMATICS
- 1ST_MIXER_BPF_SWITCH
- +3v3 60mA
- Tune L5 and
  L8 to 146MHz
- L8 and L9 at
  right angles
  with shield
- L5 and L8 at
  right angles
  with shield
- Tune L25
  to 146MHz
- Tune L8 and
  L9 to 146MHz
- 2.2pF.50V | 2.2pF.50V
- Note: Have to hook up I2C lines on Si570 & Si5351A
- 260nH
- Note: L22 | 5.2uH +/- 10% Q>20
- Alternate load:
  Same PCB layout
  0.4dB IL
  Poorer attn
- L23      15uH +/- 10% Q>20
- L21      9.2uH +/- 10% Q>20
- L20      5.7uH +/- 10% Q>20
- GND
- 3T 6.25mm
- TERMINATION INSENSITIVE AMPLIFIER
- DRIVER_PA
- from BPF/switch
- Mount Ls at right angles
- 33p, 47p, 33p cap nets
  must be zero length
- Load/Adjust R92/C99 if PA
  stability is a problem
- SM2000 -
- A

## Sheet 4 of 4
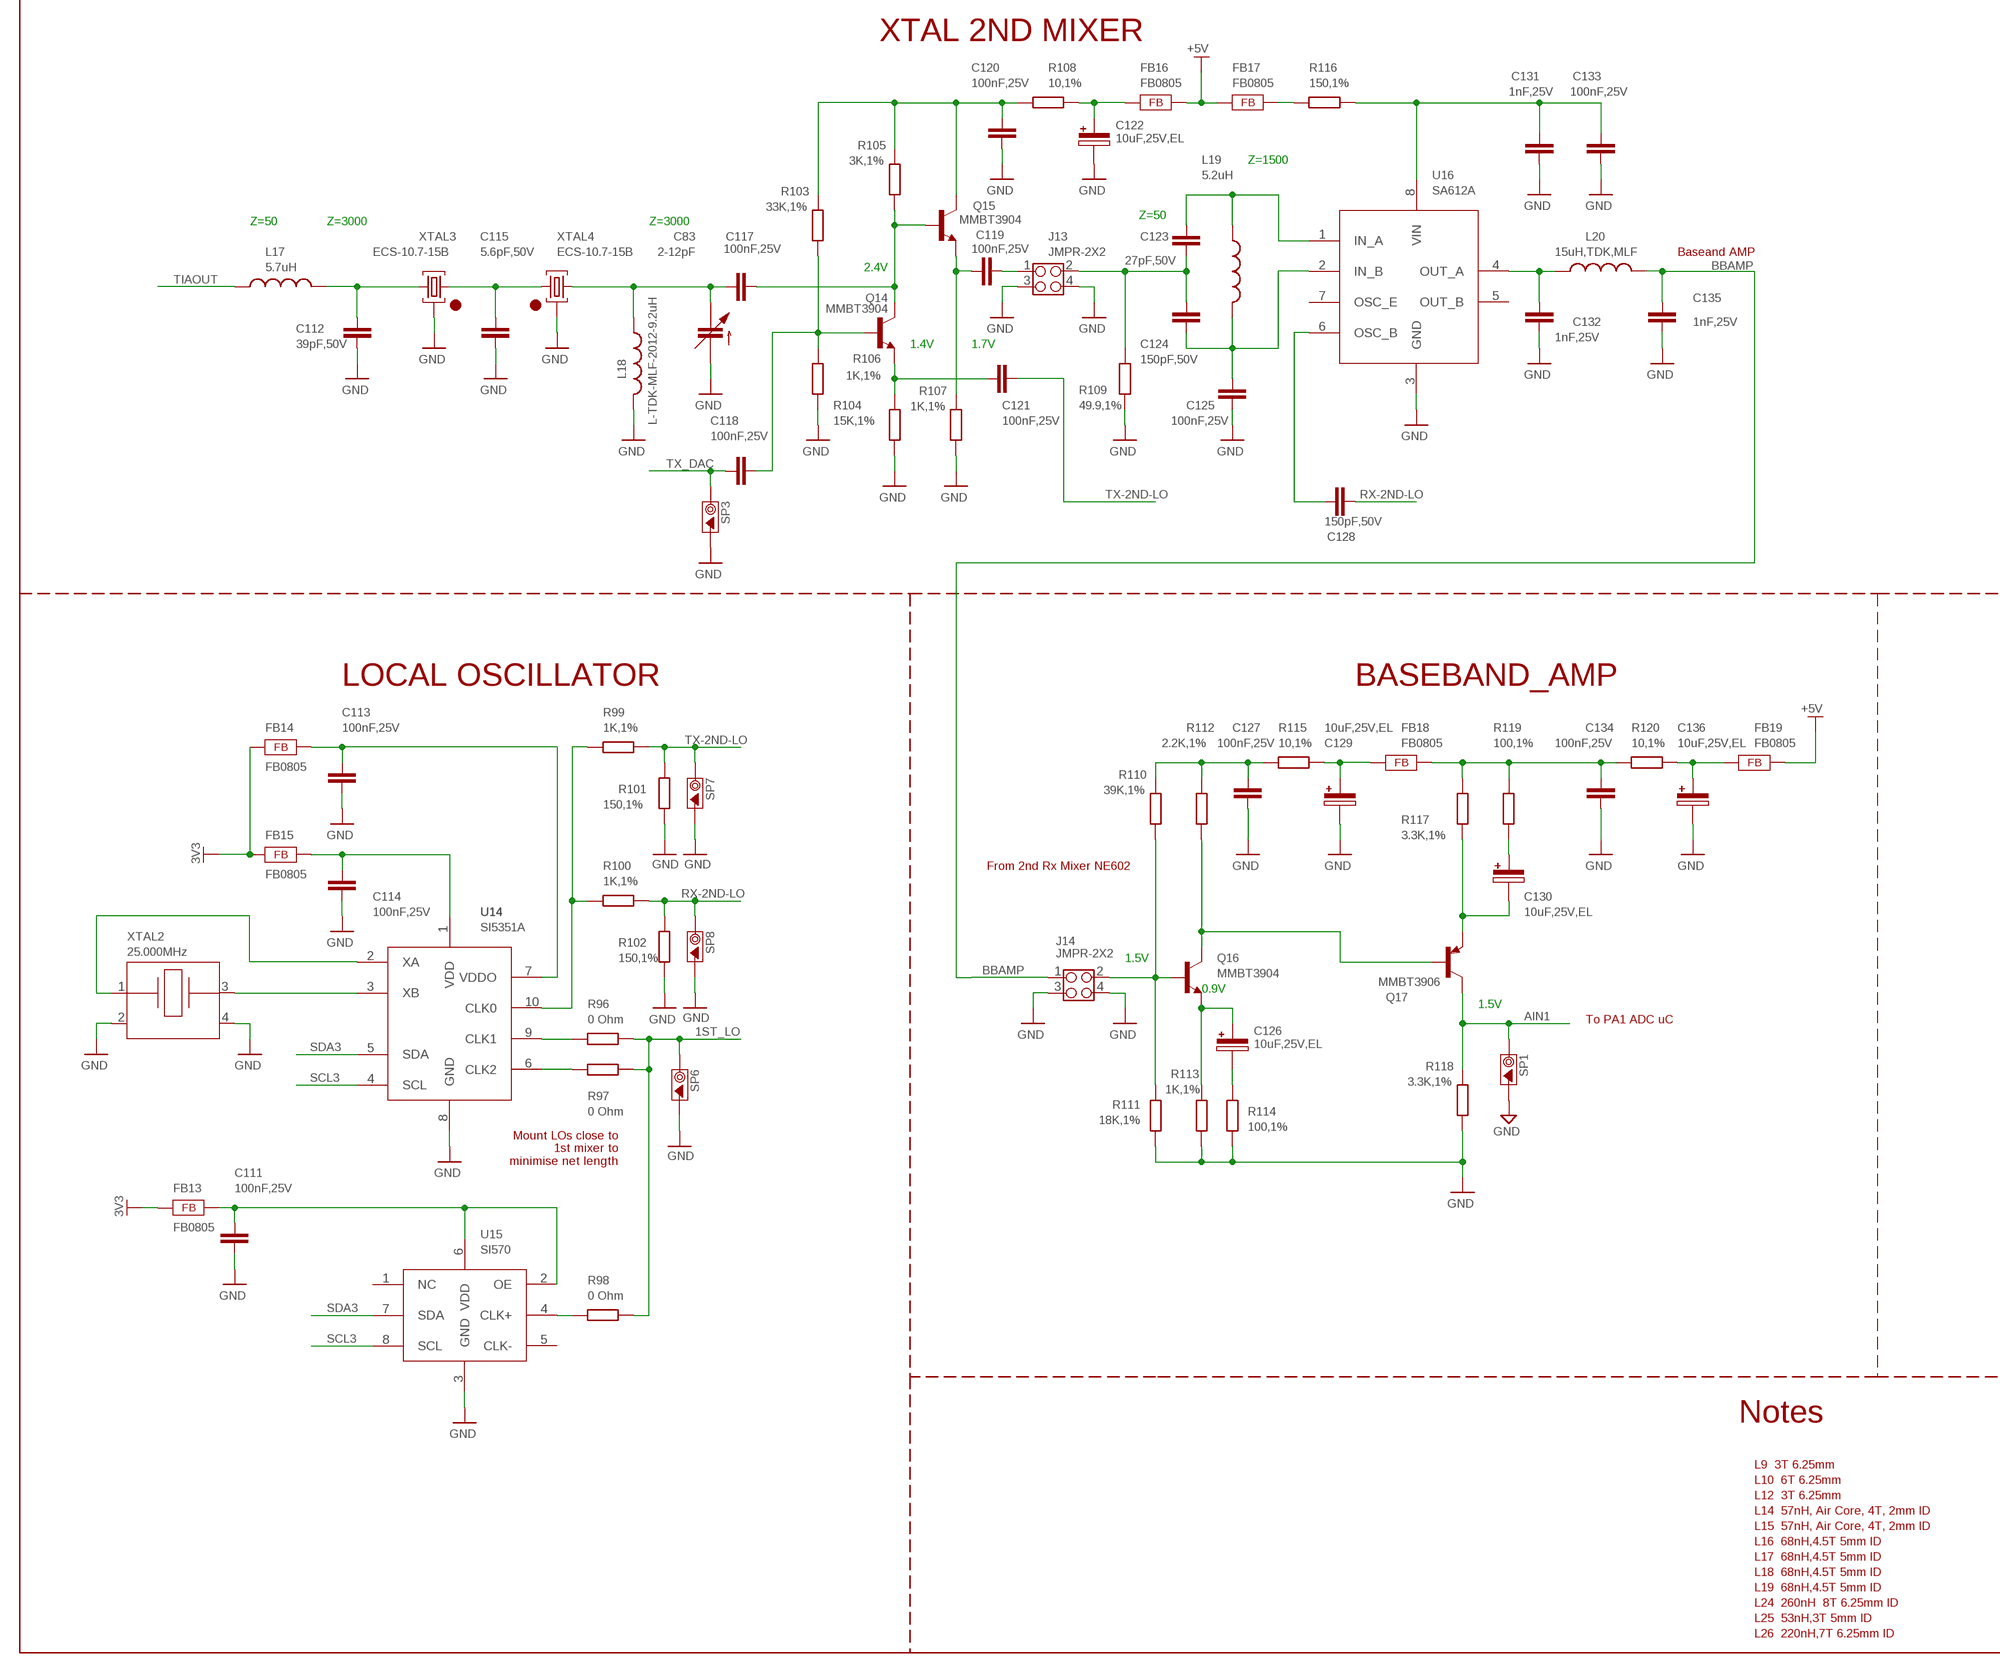
[diagram p4: schematic, sheet 4, part 1 of 2]
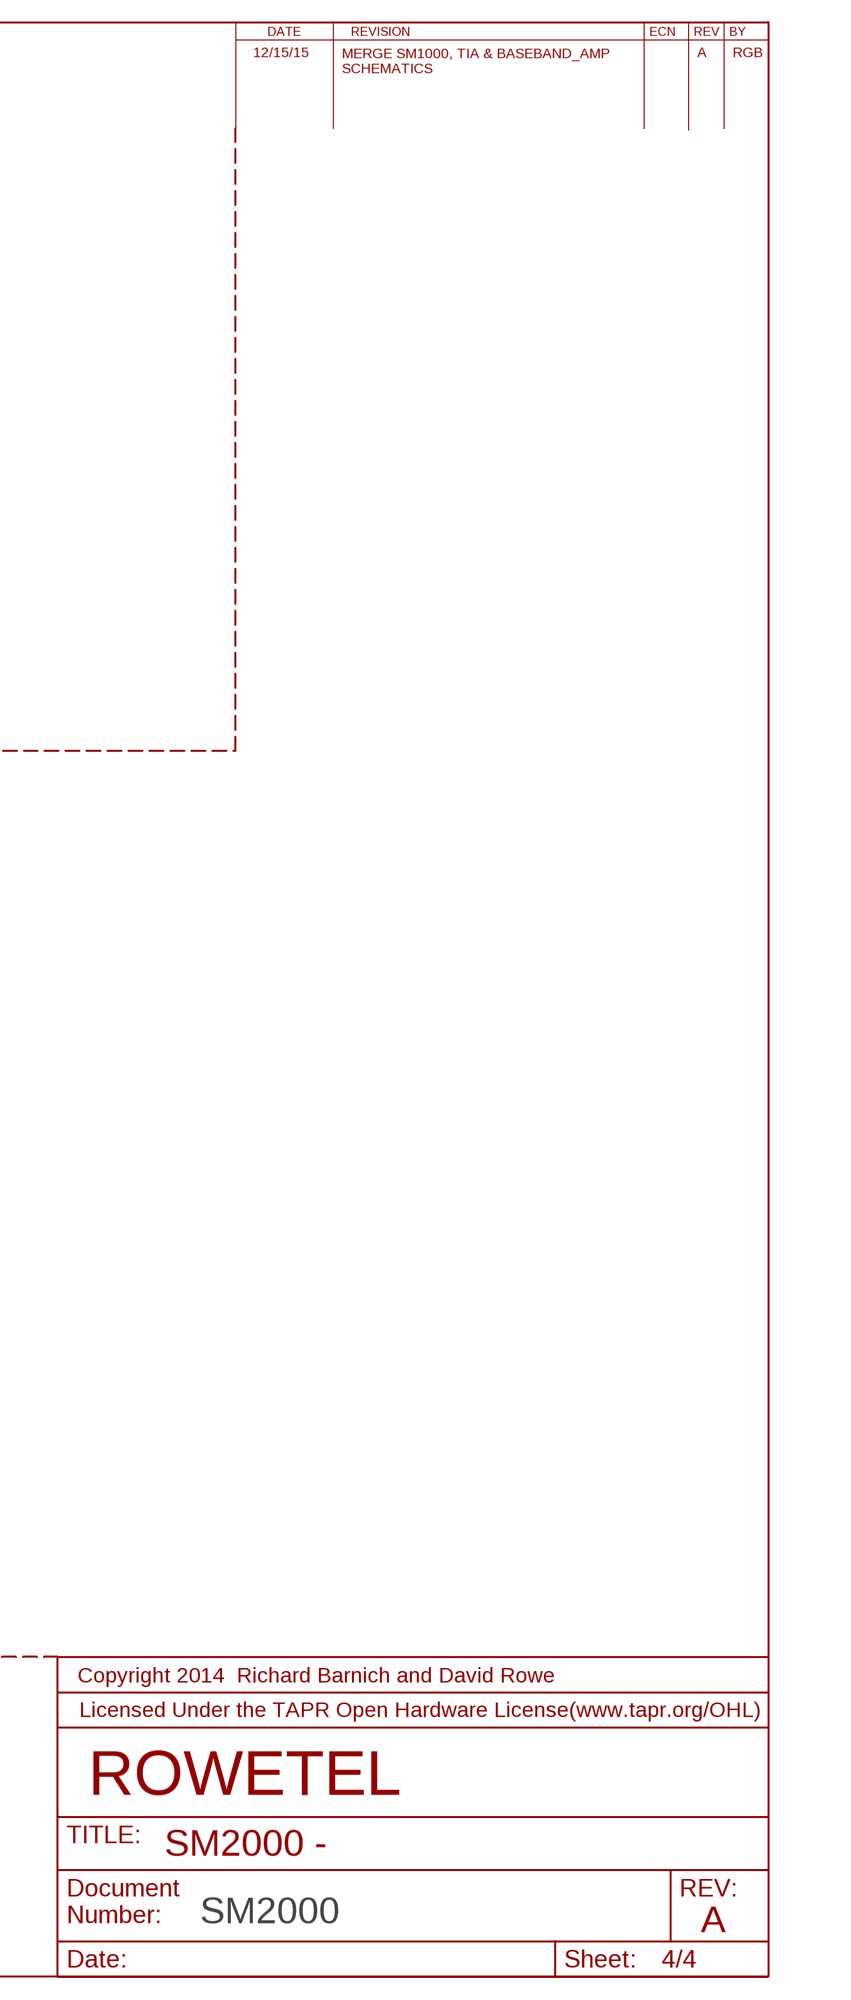
[diagram p5: schematic, sheet 4, part 2 of 2]

### Parts
C83  2-12pF  TRIMCAP_VAR_2222_V  [TRIMCAP_VAR_2222_V]
C111  100nF,25V  CAP-0805  [C0805]
C112  39pF,50V  CAP-0805  [C0805]
C113  100nF,25V  CAP-0805  [C0805]
C114  100nF,25V  CAP-0805  [C0805]
C115  5.6pF,50V  CAP-0805  [C0805]
C117  100nF,25V  CAP-0805  [C0805]
C118  100nF,25V  CAP-0805  [C0805]
C119  100nF,25V  CAP-0805  [C0805]
C120  100nF,25V  CAP-0805  [C0805]
C121  100nF,25V  CAP-0805  [C0805]
C122  10uF,25V,EL  CAP-10UF-WJ5  [NICHICON-WJ-5]
C123  27pF,50V  CAP-0805  [C0805]
C124  150pF,50V  CAP-0805  [C0805]
C125  100nF,25V  CAP-0805  [C0805]
C126  10uF,25V,EL  CAP-10UF-WJ5  [NICHICON-WJ-5]
C127  100nF,25V  CAP-0805  [C0805]
C128  150pF,50V  CAP-0805  [C0805]
C129  10uF,25V,EL  CAP-10UF-WJ5  [NICHICON-WJ-5]
C130  10uF,25V,EL  CAP-10UF-WJ5  [NICHICON-WJ-5]
C131  1nF,25V  CAP-0805  [C0805]
C132  1nF,25V  CAP-0805  [C0805]
C133  100nF,25V  CAP-0805  [C0805]
C134  100nF,25V  CAP-0805  [C0805]
C135  1nF,25V  CAP-0805  [C0805]
C136  10uF,25V,EL  CAP-10UF-WJ5  [NICHICON-WJ-5]
FB13  FB0805  [FE0805]
FB14  FB0805  [FE0805]
FB15  FB0805  [FE0805]
FB16  FB0805  [FE0805]
FB17  FB0805  [FE0805]
FB18  FB0805  [FE0805]
FB19  FB0805  [FE0805]
J13  JMPR-2X2  [JMPR-2X2X.1]
J14  JMPR-2X2  [JMPR-2X2X.1]
L17  5.7uH  L-TDK-MLF-2012  [L-TDK-MLF2012]
L18  L-TDK-MLF-2012-9.2uH  L-TDK-MLF-2012  [L-TDK-MLF2012]
L19  5.2uH  L-TDK-MLF-2012  [L-TDK-MLF2012]
L20  15uH,TDK,MLF  L-TDK-MLF-2012  [L-TDK-MLF2012]
Q14  MMBT3904  [SOT23]
Q15  MMBT3904  [SOT23]
Q16  MMBT3904  [SOT23]
Q17  MMBT3906  [SOT23]
R96  0 Ohm  RES-0805  [R0805]
R97  0 Ohm  RES-0805  [R0805]
R98  0 Ohm  RES-0805  [R0805]
R99  1K,1%  RES-0805  [R0805]
R100  1K,1%  RES-0805  [R0805]
R101  150,1%  RES-0805  [R0805]
R102  150,1%  RES-0805  [R0805]
R103  33K,1%  RES-0805  [R0805]
R104  15K,1%  RES-0805  [R0805]
R105  3K,1%  RES-0805  [R0805]
R106  1K,1%  RES-0805  [R0805]
R107  1K,1%  RES-0805  [R0805]
R108  10,1%  RES-0805  [R0805]
R109  49.9,1%  RES-0805  [R0805]
R110  39K,1%  RES-0805  [R0805]
R111  18K,1%  RES-0805  [R0805]
R112  2.2K,1%  RES-0805  [R0805]
R113  1K,1%  RES-0805  [R0805]
R114  100,1%  RES-0805  [R0805]
R115  10,1%  RES-0805  [R0805]
R116  150,1%  RES-0805  [R0805]
R117  3.3K,1%  RES-0805  [R0805]
R118  3.3K,1%  RES-0805  [R0805]
R119  100,1%  RES-0805  [R0805]
R120  10,1%  RES-0805  [R0805]
SP1  SCOPE_PAD  [SCOPE_PAD]
SP3  SCOPE_PAD  [SCOPE_PAD]
SP6  SCOPE_PAD  [SCOPE_PAD]
SP7  SCOPE_PAD  [SCOPE_PAD]
SP8  SCOPE_PAD  [SCOPE_PAD]
U14  SI5351A  [MSOP10]
U15  SI570  [SI570]
U16  SA612A  [SO-08]
XTAL2  25.000MHz  CTS-405  [CTS-405]
XTAL3  ECS-10.7-15B  ECS-10.7-15BECS-10.7-12A  [HC49U]
XTAL4  ECS-10.7-15B  ECS-10.7-15BECS-10.7-12A  [HC49U]

### Nets
1ST_LO: R96.1 R97.1 R98.1 SP6.1 ; also sheet 3
3V3: FB13.1 FB14.1 FB15.1 ; also sheet 1,2
+5V: FB16.2 FB17.1 FB19.2 ; also sheet 1,2
AIN1: Q17.3(C) R118.2 SP1.1 ; also sheet 1
BBAMP: C135.2 J14.1 L20.P$2
GND: C83.S C111.2 C112.2 C113.2 C114.2 C115.2 C120.2 C122.2 C125.1 C127.2 C129.2 C131.1 C132.1 C133.1 C134.2 C135.1 C136.2 J13.3 J13.4 J14.3 J14.4 L18.P$2 R101.2 R102.2 R104.1 R106.1 R107.1 R109.1 R111.1 R113.1 R114.1 R118.1 SP1.2 SP3.2 SP6.2 SP7.2 SP8.2 U14.8(GND) U15.3(GND) U16.3(GND) XTAL2.2 XTAL2.4 XTAL3.2 XTAL4.2 ; also sheet 1,2,3
N$2: U14.2(XA) XTAL2.1
N$40: C119.2 J13.1
N$47: C114.1 FB15.2 U14.1(VDD)
N$49: C123.1 C124.2 J13.2 R109.2
N$51: C124.1 C125.2 L19.P$2 U16.2(IN_B)
N$80: U14.3(XB) XTAL2.3
N$101: C126.1 Q16.2(E) R113.2
N$102: C134.1 FB18.2 R117.2 R119.2 R120.2
N$103: C127.1 R110.2 R112.2 R115.2
N$104: J14.2 Q16.1(B) R110.1 R111.2
N$105: Q16.3(C) Q17.1(B) R112.1
N$106: C130.2 Q17.2(E) R117.1
N$107: C129.1 FB18.1 R115.1
N$108: C126.2 R114.2
N$109: C130.1 R119.1
N$111: C136.1 FB19.1 R120.1
N$119: C111.1 FB13.2 U15.2(OE) U15.6(VDD)
N$120: C113.1 FB14.2 U14.7(VDDO)
N$121: R96.2 U14.9(CLK1)
N$122: R97.2 U14.6(CLK2)
N$123: R98.2 U15.4(CLK+)
N$124: R99.2 R100.2 U14.10(CLK0)
N$140: C120.1 Q15.3(C) R103.2 R105.2 R108.2
N$141: C117.2 Q14.3(C) Q15.1(B) R105.1
N$142: C122.1 FB16.1 R108.1
N$143: C112.1 L17.P$2 XTAL3.3
N$144: C115.1 XTAL3.1 XTAL4.1
N$145: C83.R1(R) C83.R2(R) C117.1 L18.P$1 XTAL4.3
N$146: C118.1 Q14.1(B) R103.1 R104.2
N$147: C121.1 Q14.2(E) R106.2
N$148: C119.1 Q15.2(E) R107.2
N$151: C123.2 L19.P$1 U16.1(IN_A)
N$152: FB17.2 R116.2
N$153: C131.2 C133.2 R116.1 U16.8(VIN)
N$154: C128.2 U16.6(OSC_B)
N$156: C132.2 L20.P$1 U16.4(OUT_A)
RX-2ND-LO: C128.1 R100.1 R102.1 SP8.1
SCL3: U14.4(SCL) U15.8(SCL) ; also sheet 1
SDA3: U14.5(SDA) U15.7(SDA) ; also sheet 1
TIAOUT: L17.P$1 ; also sheet 3
TX-2ND-LO: C121.2 R99.1 R101.1 SP7.1
TX_DAC: C118.2 SP3.1 ; also sheet 1
Unconnected: U15.1(NC) U15.5(CLK-) U16.5(OUT_B) U16.7(OSC_E)

### Notes on the sheet
- 12/15/15 | A | RGB
- MERGE SM1000, TIA & BASEBAND_AMP
  SCHEMATICS
- XTAL 2ND MIXER
- Z=1500
- Z=50
- Z=50 | Z=3000 | Z=3000
- Baseand AMP
- 2.4V
- 1.4V | 1.7V
- LOCAL OSCILLATOR | BASEBAND_AMP
- From 2nd Rx Mixer NE602
- 1.5V
- 0.9V
- 1.5V
- To PA1 ADC uC
- Mount LOs close to
  1st mixer to
  minimise net length
- Notes
- L9  3T 6.25mm
- L10  6T 6.25mm
- L12  3T 6.25mm
- L14  57nH, Air Core, 4T, 2mm ID
- L15  57nH, Air Core, 4T, 2mm ID
- L16  68nH,4.5T 5mm ID | SM2000 -
- L17  68nH,4.5T 5mm ID
- L18  68nH,4.5T 5mm ID
- L19  68nH,4.5T 5mm ID
- L24  260nH  8T 6.25mm ID
- A
- L25  53nH,3T 5mm ID
- L26  220nH,7T 6.25mm ID

## Library data of the parts
C1-C25 C27 C28 C30 C33 C35 C37-C41 C45-C51 C53 C56-C82 C84-C87 C89-C108 C110-C115 C117-C121 C123-C125 C127 C128 C131-C135 C137 C138 = _RoweTel:CAP-0805
C26 C29 C36 C42-C44 C54 = _RoweTel:CAP-1210
C31 C32 = _RoweTel:NICHICON-WX-6.3
C34 C52 C55 = _RoweTel:CAP-CHEMI-MVE-HA0
C83 = _RoweTel:TRIMCAP_VAR_2222_V
C109 = _RoweTel:CAP-CHEMI-F80
C122 C126 C129 C130 C136 = _RoweTel:CAP-10UF-WJ5
CN1 CN3 = _Coherix:HDR100-3
CN2 CN6 CN7 = _RoweTel:ST-3509
CN4 = _RoweTel:JS-MU3-002
CN5 = _RoweTel:DS-0518
D1 D2 = _RoweTel:PESD5ZX
D3 D5 = _RoweTel:PTVS20VP1UP
D4 = _RoweTel:B330B
D6-D9 = _RoweTel:BAR64-02V
D10 = _RoweTel:BAT18
FB1-FB20 = _RoweTel:FB0805
J1 J3 J5 = _Coherix:JMP-2PIN
J2 = _RoweTel:HDR100-7
J4 = _RoweTel:CONN-BOOM-XH-2A
J6-J14 = _RoweTel:JMPR-2X2
L1 = _RoweTel:SRR5028
L2-L6 L8-L11 L14 L16 = _RoweTel:L-ROWE_15X10
L12 L13 L15 = _RoweTel:RFC
L17-L20 = _RoweTel:L-TDK-MLF-2012
LED1-LED4 LED7 = _RoweTel:LTST-S220K
LED5 LED6 LED8-LED11 = _RoweTel:SML-LX0603SRW
MIC1 = _RoweTel:CMA-4544PF-W
P6-P9 = _Coherix:TPAD50
PCB1 = _Coherix:PCB
Q1 Q3 Q5-Q10 Q14-Q16 = _RoweTel:MMBT3904
Q2 Q4 = _RoweTel:STR2P3LLH6
Q11 = _RoweTel:BFR92
Q12 = _RoweTel:BFQ19
Q13 = _RoweTel:RD01MUS2
Q17 = _RoweTel:MMBT3906
R1-R38 R40-R47 R50-R120 = _RoweTel:RES-0805
R39 = _RoweTel:POT3361
R48 = _RoweTel:POT-3310C
R49 = _RoweTel:RES-1206
S1-S7 = _RoweTel:SGND
SH1-SH3 = _Coherix:SHUNT,0.1IN
SP1-SP9 = _RoweTel:SCOPE_PAD
SW1 = _RoweTel:TS-02B
SW2 SW5 = _RoweTel:SW-LC2259
SW3 SW4 = _RoweTel:TS-026
U1 = _RoweTel:STM32F407
U2 = _RoweTel:STMPS2141
U3 = AA-IC:EMIF02-USB03F2
U4 = _RoweTel:I2C-EEPROM-256K
U5 = _RoweTel:L78MXX
U6 U8 = _RoweTel:LD1117AS33
U7 U13 = _RoweTel:LMV341
U9 = _RoweTel:TPS54329E
U10 = _RoweTel:LM386?-*: Low Voltage Audio Power Amplifier Source: http://cache.national.com/ds/LM/LM386.pdf
U11 = _RoweTel:ADE-1
U12 = _RoweTel:PGA-103+
U14 = _RoweTel:SI5351A
U15 = _RoweTel:SI570
U16 = _RoweTel:SA612A
X1 = _RoweTel:BU-SMA-H: FEMALE SMA CONNECTOR Radiall; OC_FARNELL: unknown; OC_NEWARK: unknown
XTAL1 XTAL2 = _RoweTel:CTS-405
XTAL3 XTAL4 = _RoweTel:ECS-10.7-15B: MONOLITHIC CRYSTAL FILTERS Source: http://www.presto.co.uk; OC_FARNELL: unknown; OC_NEWARK: unknown

## Net classes
1 Stripline: width 0.508 mm, drill 0.508 mm, clearance 0.508 mm